# EAGLE design ict_v361-xs-boost (EAGLE 9.6.2)
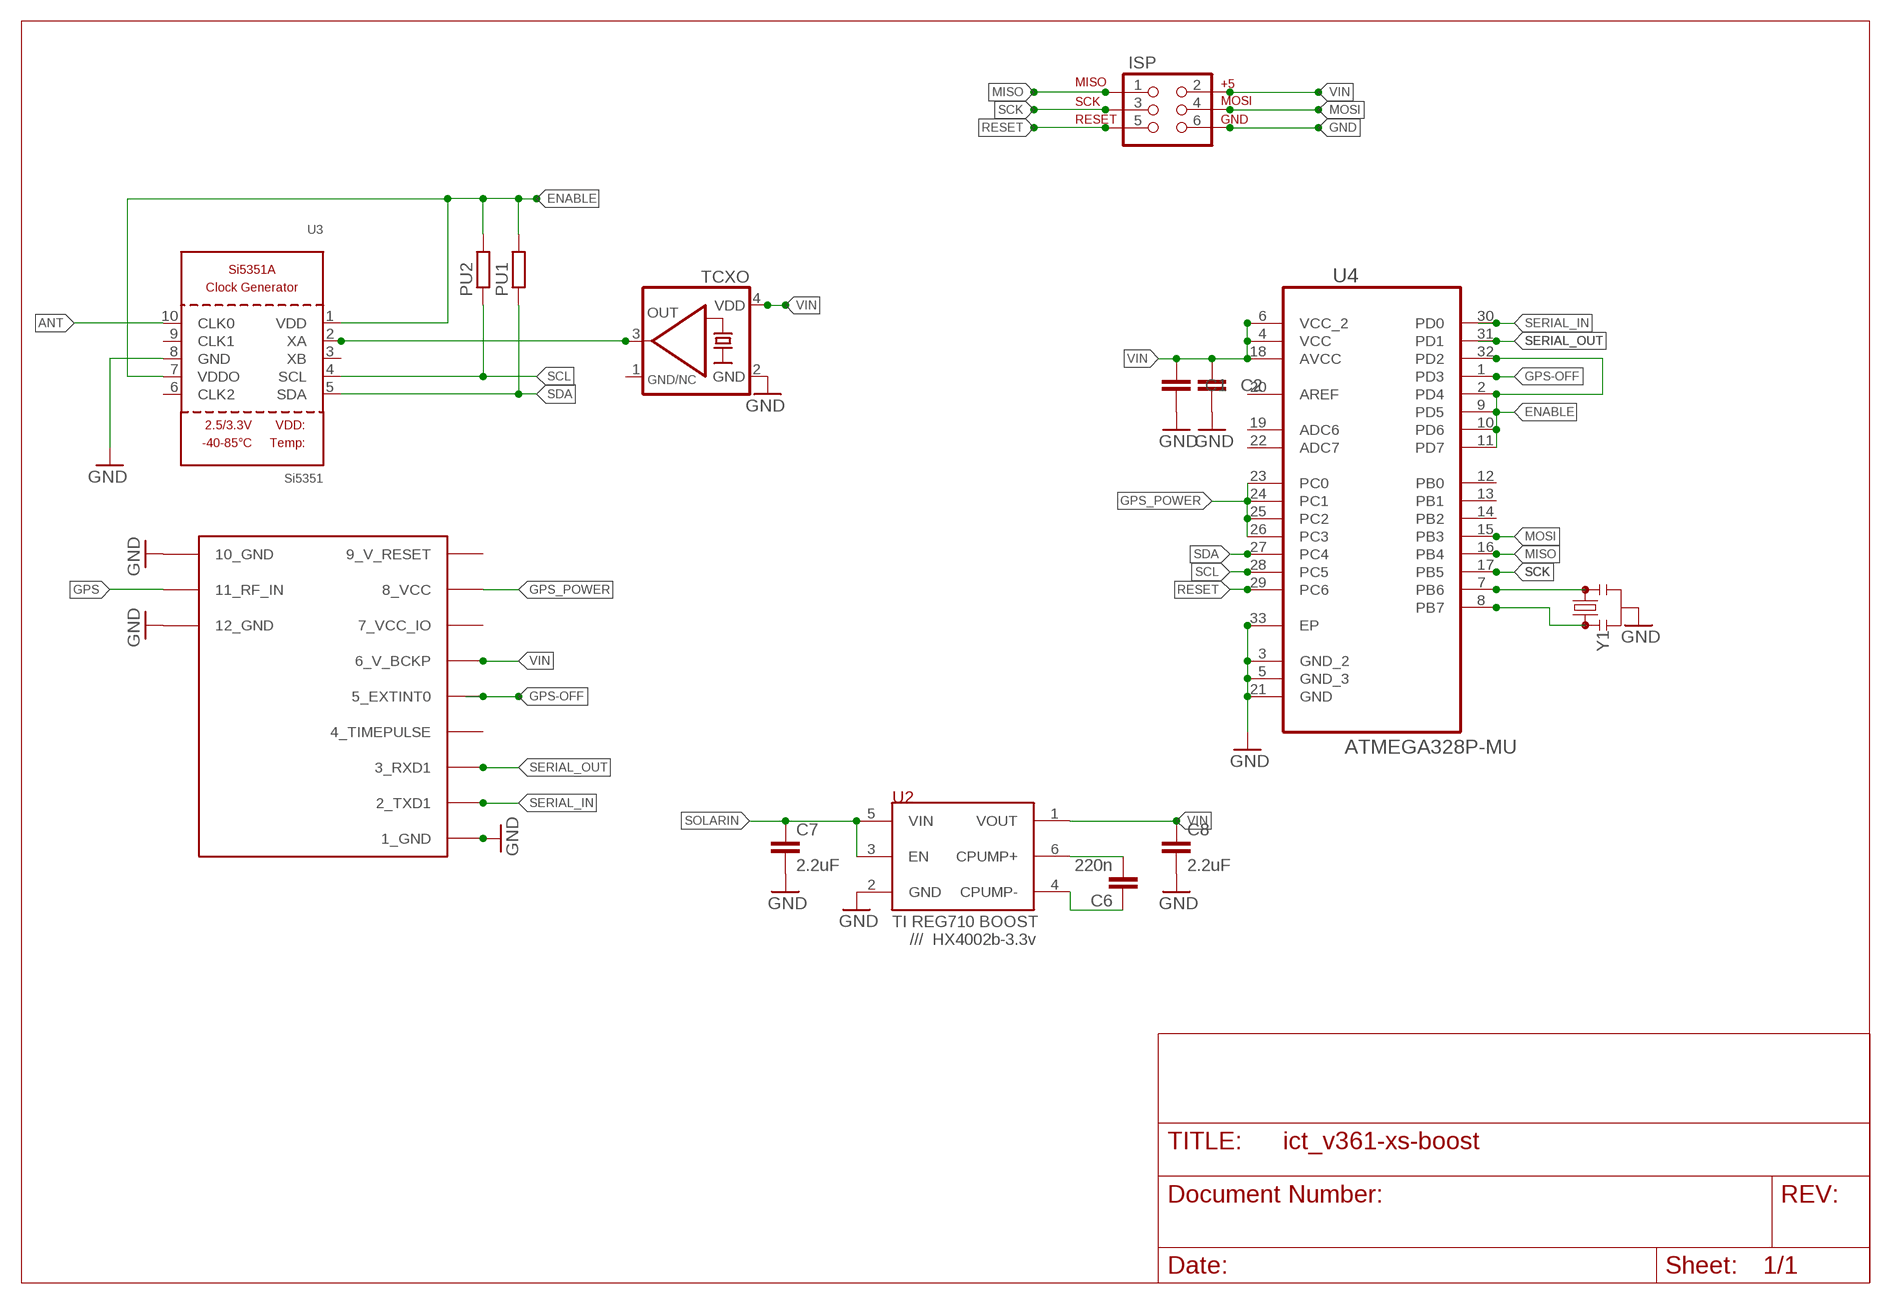
[diagram p0: schematic, sheet 1]

## Parts
C1  C-EUC0603K  [C0603K]
C2  C-EUC0603K  [C0603K]
C6  220n  CAP0603-CAP  [0603-CAP]
C7  2.2uF  CAP0603-CAP  [0603-CAP]
C8  2.2uF  CAP0603-CAP  [0603-CAP]
ISP  AVR_SPI_PRG_6PTH  [2X3]
PU1  R-EU_R0603  [R0603]
PU2  R-EU_R0603  [R0603]
TCXO  KXO-TCXO-CMOS-84  [3.2X2.5_KXO-84-TCXO]
U2  /// HX4002b-3.3v  TI-REG710  [SOT-23-6L]
U3  Si5351  SI5351A  [MSOP10]
U4  ATMEGA328P-MU  [QFN50P500X500X100-33N]
U$2  UBLOX_MAX  [UBLOX_MAX]
Y1  RESONATORSMD-4.5X2.0  [RESONATOR-SMD-4.5X2.0]

## Nets
ANT: U3.10(CLK0)
ENABLE: PU1.2 PU2.2 U3.1(VDD) U3.7(VDDO) U4.2(PD4) U4.9(PD5) U4.10(PD6) U4.11(PD7) U4.32(PD2)
GND: C1.2 C2.2 C7.2 C8.2 ISP.6 TCXO.2(GND) U2.2(GND) U3.8(GND) U4.3(GND_2) U4.5(GND_3) U4.21(GND) U4.33(EP) U$2.1_GND U$2.10_GND U$2.12_GND Y1.2
GPS: U$2.11_RF_IN
GPS-OFF: U4.1(PD3) U$2.5_EXTINT0
GPS_POWER: U4.23(PC0) U4.24(PC1) U4.25(PC2) U4.26(PC3) U$2.8_VCC
MISO: ISP.1 U4.16(PB4)
MOSI: ISP.4 U4.15(PB3)
N$1: U4.7(PB6) Y1.3
N$3: U4.8(PB7) Y1.1
N$19: TCXO.3(OUT) U3.2(XA)
N$25: C6.2 U2.6(CPUMP+)
N$28: C6.1 U2.4(CPUMP-)
RESET: ISP.5 U4.29(PC6)
SCK: ISP.3 U4.17(PB5)
SCL: PU2.1 U3.4(SCL) U4.28(PC5)
SDA: PU1.1 U3.5(SDA) U4.27(PC4)
SERIAL_IN: U4.30(PD0) U$2.2_TXD1
SERIAL_OUT: U4.31(PD1) U$2.3_RXD1
SOLARIN: C7.1 U2.3(EN) U2.5(VIN)
VIN: C1.1 C2.1 C8.1 ISP.2 TCXO.4(VDD) U2.1(VOUT) U4.4(VCC) U4.6(VCC_2) U4.18(AVCC) U$2.6_V_BCKP
Unconnected: U3.3(XB) U3.6(CLK2) U3.9(CLK1) U4.12(PB0) U4.13(PB1) U4.14(PB2) U4.19(ADC6) U4.20(AREF) U4.22(ADC7) U$2.4_TIMEPULSE

## Power pins joined to a net without a drawn wire
7_VCC_IO: U$2.7_VCC_IO
9_V_RESET: U$2.9_V_RESET
GND/NC: TCXO.1(GND/NC)

## Library data of the parts
C1 C2 = rcl:C-EU: CAPACITOR, European symbol; SPICEPREFIX: C
C6-C8 = KippKitts:CAP: Capacitor Standard 0603 ceramic capacitor, and 0.1" leaded capacitor.
ISP = SparkFun:AVR_SPI_PRG_6: AVR ISP 6 Pin This is the reduced ISP connector for AVR programming. Common on Arduino. This footprint will take up less PCB space and can be used with a 10-pin to 6-pin adapter such as SKU: BOB-08508
PU1 PU2 = resistor:R-EU_: RESISTOR, European symbol
TCXO = crystal-geyer_V1_0:KXO-TCXO-CMOS: TCXO : CMOS - Serie Model Size l/w/h [mm] Frequency Range Frequency Stability Temp. Range [°C] Output AECQ 200 availabel Datasheet KXO-86 KXO-84 KXO-83 KXO-82 2.5/2.0/0.7 3.2/2.5/1.0 5.0/3.2/1.5 7.0/5.0/2.4 13,0 ~ 40,0 MHz 10,0 ~ 40,0 MHz 10,0 ~ 40,0 MHz 10,0 ~ 30,0 MHz ±1,0 … ±2,5ppm ±1,0 … ±2,5ppm ±1,0 … ±3,0ppm ±1,0 … ±3,0ppm (*) -30°C …+75°C (*) -40°C …+85°C (*) -40°C …+85°C (*) -30°C …+80°C CMOS CMOS CMOS CMOS - - - - KXO-86.pdf <http://www.geyer-electronic.de/uploads/tx_userartikelfrequenz/GEYER-KXO-86-TCXO-HCMOS.pdf> KXO-84.pdf <http://www.geyer-electronic.de/uploads/tx_userartikelfrequenz/GEYER-KXO-84-TCXO-HCMOS.pdf> KXO-83.pdf <http://www.geyer-electronic.de/uploads/tx_userartikelfrequenz/GEYER-KXO-83-TCXO-HCMOS.pdf> KXO-82.pdf <http://www.geyer-electronic.de/uploads/tx_userartikelfrequenz/GEYER-KXO-82-TCXO-HCMOS.pdf> <http://www.geyer-electronic.de/fileadmin/template/img/logo-geyer-electronic.png> Details see: http://www.geyer-electronic.de/Frequenz-Produkte.9.0.html Created 2016-06-07, Hans Locher 2016 (C) Geyer Quartz Technology KXO86,KXO84,KXO83,KXO82;2550;3225;5032;7050;2,5x2,0;3,2x2,5;2.5x2.0;3.2x2.5,5,0x3,2;7,0x5,0,5.0x3.2,7.0x5.0
U2 = arducorder-mini:TI-REG710: Texas Instruments REG710 mini switching regulator (~30ma)
U3 = microbuilder:SI5351A: Si5351A 8kHz-160MHz I2C Clock Generator VDD: 2.5V or 3.3V Input Range: 25MHz or 27MHz XTAL User selectable internal input load capacitors: 6, 8 or 10 pF Output Impedance: 85 Ohm Output Load Capacitance: 5-15pF Operating Temperature: -40°C - 85°C Operating Current (3 outputs): 35mA Output buffer voltage (VDDO): 1.8, 2.5 or 3.3V Note: If VDDO is not used it should be connected to VDD. Unused clock out pins should be left floating.
U4 = ava:ATMEGA328P-MU: Programmable Flash; MPN: ATMEGA328P-MU; OC_FARNELL: 1748522; OC_NEWARK: 26R2526; PACKAGE: QFN-32; SUPPLIER: Atmel
U$2 = Max gps:UBLOX_MAX: UBLOX MAX
Y1 = SparkFun-Clocks:RESONATOR: Resonators (Generic) Ceramic resonators are clock-generating components, often used to control timing in microcontrollers. They usually have 3 pins: two pins for oscillation, and one pin for ground. Compared to crystals, resonators have worse tolerance, but are usually much cheaper. Plus, they have built-in load capacitors! These devices are used on boards like the Arduino Pro 8MHz <https://www.sparkfun.com/products/11114> and Arduino Pro 16MHz <https://www.sparkfun.com/products/11113>.

## Net classes
0 default: width 0.203 mm
1 vcc: width 0.152 mm, clearance 0.152 mm

## Board
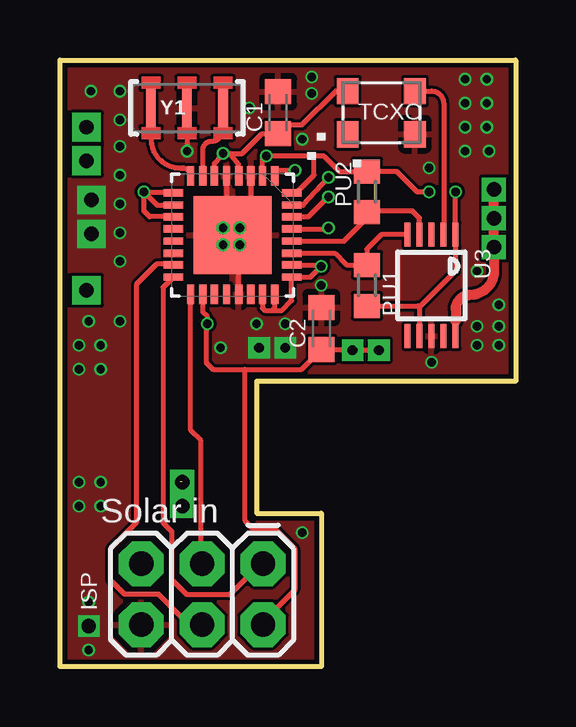
[diagram p1: board, top side]
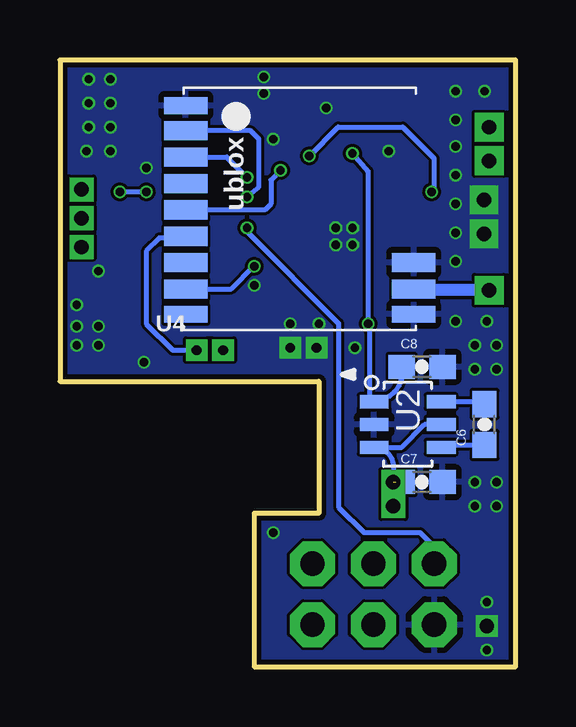
[diagram p2: board, bottom side, seen from below]

Size 19 x 25.3 mm. Coordinates in mm from the lower left corner, seen from the top.
Outline: 0,25.3 19,25.3 19,11.9 8.2,11.9 8.2,6.4 10.9,6.4 10.9,0 0,0 0,25.3
Copper layers (1*16): Top 0.035559375mm / dielectric 1.6mm / Bottom 0.035559375mm
Design rules "jlcpcb2layer *": minimum track width 5mil, minimum drill 12mil, track to track 5mil, track to pad 5mil, pad to pad 5mil, via to via 5mil, smd to smd 5mil, copper to edge 8mil, drill to drill 6mil, minimum pad ring 5mil, minimum via ring 3mil, stop-mask expansion 2.5mil, vias tented up to drill 14mil, thermal gap 10mil

### Footprints (pad centres in the part's own frame; a part is rotated, then mirrored left to right if it is on the bottom)
C0603K = smd 1.05 x 1.08: 1 -0.875,0; 2 0.875,0
0603-CAP = smd 1.1 x 1: 1 -0.85,0; 2 0.85,0
2X3 = drill 1.016 pad 1.88 octagon: 1 0,0; 2 0,2.54; 3 2.54,0; 4 2.54,2.54; 5 5.08,0; 6 5.08,2.54
R0603 = smd 1 x 1.1: 1 -0.85,0; 2 0.85,0
3.2X2.5_KXO-84-TCXO = smd 0.9 x 1.1: 1 -1.4,-0.9; 2 1.4,-0.9; 3 1.4,0.9; 4 -1.4,0.9
SOT-23-6L = smd 0.55 x 1.2: 1 -0.95,-1.4; 2 0,-1.4; 3 0.95,-1.4; 4 0.95,1.4; 5 0,1.4; 6 -0.95,1.4
MSOP10 = smd 0.25 x 1: 1 -1,-2.113; 2 -0.5,-2.113; 3 0,-2.113; 4 0.5,-2.113; 5 1,-2.113; 6 1,2.113; 7 0.5,2.113; 8 0,2.113; 9 -0.5,2.113; 10 -1,2.113
QFN50P500X500X100-33N = smd 0.813 x 0.305: 1 -2.464,1.753; 2 -2.464,1.245; 3 -2.464,0.762; 4 -2.464,0.254; 5 -2.464,-0.254; 6 -2.464,-0.762; 7 -2.464,-1.245; 8 -2.464,-1.753; 17 2.464,-1.753; 18 2.464,-1.245; 19 2.464,-0.762; 20 2.464,-0.254; 21 2.464,0.254; 22 2.464,0.762; 23 2.464,1.245; 24 2.464,1.753 | smd 0.305 x 0.813: 9 -1.753,-2.464; 10 -1.245,-2.464; 11 -0.762,-2.464; 12 -0.254,-2.464; 13 0.254,-2.464; 14 0.762,-2.464; 15 1.245,-2.464; 16 1.753,-2.464; 25 1.753,2.464; 26 1.245,2.464; 27 0.762,2.464; 28 0.254,2.464; 29 -0.254,2.464; 30 -0.762,2.464; 31 -1.245,2.464; 32 -1.753,2.464 | smd 3.251 x 3.251: 33 0,0
UBLOX_MAX = smd 1.8 x 0.7: 1_GND 4.95,-4.4; 9_V_RESET 4.95,4.3; 10_GND -4.55,4.3 | smd 1.8 x 0.8: 2_TXD1 4.95,-3.35; 3_RXD1 4.95,-2.25; 4_TIMEPULSE 4.95,-1.15; 5_EXTINT0 4.95,-0.05; 6_V_BCKP 4.95,1.05; 7_VCC_IO 4.95,2.15; 8_VCC 4.95,3.25; 11_RF_IN -4.55,3.25; 12_GND -4.55,2.15
RESONATOR-SMD-4.5X2.0 = smd 0.4 x 1.6: 1 -1.5,0; 2 0,0; 3 1.5,0

### Placement (x,y rotation side)
C1  9.1,23.1 90 top
C2  10.9,14.1 90 top
C6  1.3,10.1 90 bottom
C7  3.9,7.7 0 bottom
C8  3.9,12.5 0 bottom
ISP  8.47,4.29 180 top
PU1  12.8,15.9 270 top
PU2  12.8,19.8 90 top
TCXO  13.4,23.1 0 top
U2  4.5,10.1 270 bottom
U3  15.49,15.9 180 top
U4  7.2,18 270 top
U$2  8.8,19 180 bottom
Y1  5.3,23.3 0 top

### Tracks (layer width: path | path; a pad name or v marks a point on that pad's centre or on a via)
ANT  (via drill 0.6 pad 1)
  Top 0.203: 16.5,14.4 16.49,14.39 U3.10 | v18.1,17.5 18.1,17.7
  Top 0.406: 18.1,17.6 v18.1,17.5 18.1,16.5 arc-90 17.1,15.5 arc90 16.5,14.9 16.5,14.4 | 18.1,17.7 v18.1,18.7 v18.1,19.9
ENABLE  (via drill 0.35)
  Top 0.203: 14.99,14.99 U3.7 15,13.53 | 14.99,14.99 16.49,16.49 U3.1 v16.49,19.79 v16.5,19.8 | PU1.2 14.93,15.05 14.99,14.99 | 10.6,21.3 11,21.3 11.65,20.65 PU2.2 14.05,20.65 14.9,19.8 v15.4,19.8 | 10.6,21.3 v8.6,21.3 8.45,21.14 U4.2 | U4.32 9.85,19.75 10.6,20.5 10.6,21.3 | v3.5,19.8 4.69,19.8 U4.9 | v3.5,19.8 4.05,19.25 U4.10 | v3.5,19.8 3.5,19 3.74,18.76 U4.11
  Bottom 0.203: v15.4,19.8 v16.5,19.8 | v8.6,21.3 7.4,22.5 4.7,22.5 3.4,21.2 3.4,19.9 v3.5,19.8
GND  (via drill 0.35, 0.4 pad 0.9, 0.6 pad 0.7, 0.6 pad 1.2)
  Top 0.203: 8,20.43 U4.3 7.96,18.76 U4.33 | 5.3,22.8 v5.3,21.5 | U4.21 7.45,17.75 U4.33 | U4.5 6.95,18.25 U4.33
  other vias: 2.5,21.7 15.5,12.7 18.3,13.4 1.31,19.47 1.31,18.05 1.3,24 10.9,15.9 2.5,16.9 2.5,18.1 8.3,13.3 2.5,14.4 2.5,19.3 2.5,20.5 9.4,13.3 2.5,22.8 2.5,24 1.2,14.4 8.2,14.3 9.4,14.3 7.5,18.3 6.8,18.3 6.8,17.6 7.5,17.6 10.5,24.6 18.3,15.1 18.3,14.2 17.4,13.4 7.9,23.3 1.2,1.7 15.4,20.8 10.1,22 17.4,16.5 17.4,14.2 0.8,7.7 1.7,7.7 6.7,13.3 0.8,12.4 16.9,21.5 17.9,21.5 17.8,22.5 16.9,22.5 16.9,23.5 17.8,23.5 17.8,24.5 16.9,24.5 1.2,2.7 1.2,0.7 10.1,5.6 10.5,23.9 1.7,6.7 0.8,6.7 1.7,12.4 1.7,13.4 0.8,13.4
  pour Top: -5.09,27.92 37.75,27.92 37.75,-1.19 -5.19,-1.19 -5.19,27.82
  pour Bottom: -5.19,27.92 37.75,27.92 37.75,-1.19 -5.19,-1.19
GPS  (via drill 0.6 pad 1.2)
  Bottom 0.203: 4.2,15.7 U$2.11_RF_IN
  Bottom 0.508: v1.1,15.7 4.2,15.7
GPS-OFF  (via drill 0.35)
  Top 0.203: U4.1 8.95,20.56 9.09,20.7 v9.8,20.7
  Bottom 0.203: v9.8,20.7 10.2,20.3 10.2,19.3 10.45,19.05 U$2.5_EXTINT0
GPS_POWER  (via drill 0.35)
  Top 0.203: 8.99,15.5 U4.24 8.95,14.95 8.85,14.85 | 9.76,16.75 U4.26 10.84,16.75 v10.9,16.7 10.45,16.25 U4.25 9.66,15.26 9.25,14.85 8.85,14.85 | U4.23 8.45,14.95 8.55,14.85 8.85,14.85
  Bottom 0.203: U$2.8_VCC 11.85,15.75 v10.9,16.7
MISO
  Top 0.203: ISP.1 8.36,4.29 7.1,3.02 5.28,3.02 4.66,3.64 4.66,5.64 4.3,6 4.3,15.81 U4.16
MOSI
  Top 0.203: U4.15 4.67,16.76 | 4.83,16.79 U4.15 | U4.15 4.7,16.79 4.03,16.79 3.2,15.96 3.2,6.03 2.12,4.94 2.12,3.6 2.69,3.02 4.12,3.02 5.39,1.75 ISP.4
N$1
  Top 0.203: Y1.3 6.8,22.4 arc-90 6.3,21.9 arc90 5.96,21.55 U4.7
N$3
  Top 0.203: Y1.1 3.8,22 arc90 5,20.8 5.11,20.8 arc-90 U4.8
N$7  (via drill 0.6 pad 1.2)
  other vias: 1.1,22.5
N$8  (via drill 0.6 pad 1.2)
  other vias: 1.1,21.1
N$19
  Top 0.203: TCXO.3 15.5,24 arc-90 16,23.5 16,18.02 arc-90 U3.2
N$25
  Bottom 0.203: C6.2 1.4,11.05 U2.6
N$28
  Bottom 0.203: C6.1 3,9.25 U2.4
RESET  (via drill 0.35)
  Top 0.203: U4.29 11.19,18.25 v11.2,18.3
  Bottom 0.203: v11.2,18.3 11.2,18.14 7.38,14.32 7.38,6.65 6.32,5.59 3.99,5.59 3.39,4.99 ISP.5
SCK
  Top 0.203: 5.49,15.54 U4.17 5.45,9.86 5.88,9.43 5.88,4.45 ISP.3
SCL
  Top 0.203: U4.28 11.85,17.75 12.8,18.7 PU2.1 12.85,19 14.7,19 14.99,18.71 U3.4
SDA
  Top 0.203: U3.5 13.4,18.01 12.8,17.41 PU1.1 11.95,16.75 11.46,17.24 U4.27
SERIAL_IN  (via drill 0.35)
  Top 0.203: U4.30 10.36,18.76 v11.2,19.6
  Bottom 0.203: U$2.2_TXD1 11.05,22.35 10.7,22 10.7,20 v11.2,19.6
SERIAL_OUT  (via drill 0.35)
  Top 0.203: U4.31 10.14,19.25 v11.2,20.4
  Bottom 0.203: v11.2,20.4 12.05,21.25 U$2.3_RXD1
SOLARIN  (via drill 0.35 pad 0.7, 0.6 pad 1)  (1 unrouted)
  Bottom 0.203: U2.5 3.8,10.1 4.75,9.15 U2.3 | C7.1 4.75,8 | U2.3 5.4,9.15 | U2.3 arc90 5.1,8.35 v5.1,7.7 C7.1 | C7.1 5.1,7.35
  Bottom 0.406: 5.1,7.35 v5.1,6.7
  other vias: 5,7.7
VIN  (via drill 0.35, 0.4 pad 0.9)
  Top 0.203: U4.18 5.96,14.79 6.15,14.6 v6.15,14.3 6.1,14.25 6.1,12.68 6.38,12.4 7.7,12.4 | 7.7,12.4 10.08,12.4 C2.1 12.18,13.22 v12.2,13.2 v13.3,13.2 | U4.6 6.44,20.99 6.71,21.26 v6.8,21.4 | U4.4 7.45,20.95 7.1,21.4 arc-62 v6.8,21.4 | v6.8,21.4 7.6,21.4 8.43,22.22 C1.1 9.47,22.6 10.1,22.6 11.5,24 TCXO.4 | 7.7,12.4 7.7,6.11 8.1,5.71 9.01,5.71 9.8,4.91 9.8,3.21 8.53,1.93 8.53,1.81 ISP.2
  Bottom 0.203: v6.8,21.4 6.15,20.65 v6.15,14.3 6.1,14.25 6.1,11.25 U2.1 5.82,11.12 | U$2.6_V_BCKP 13.82,17.88 14.84,17.88 15.4,17.32 15.4,14.3 14.3,13.2 v13.3,13.2 | 5.82,11.12 5.75,11.2 | C8.1 4.75,12.2 arc90 5.82,11.12

### Text on the board
tPlace: .
tNames: . | Solar in
bNames: U4